# EAGLE schematic TRN_Open_Servo (EAGLE 7.1.0)
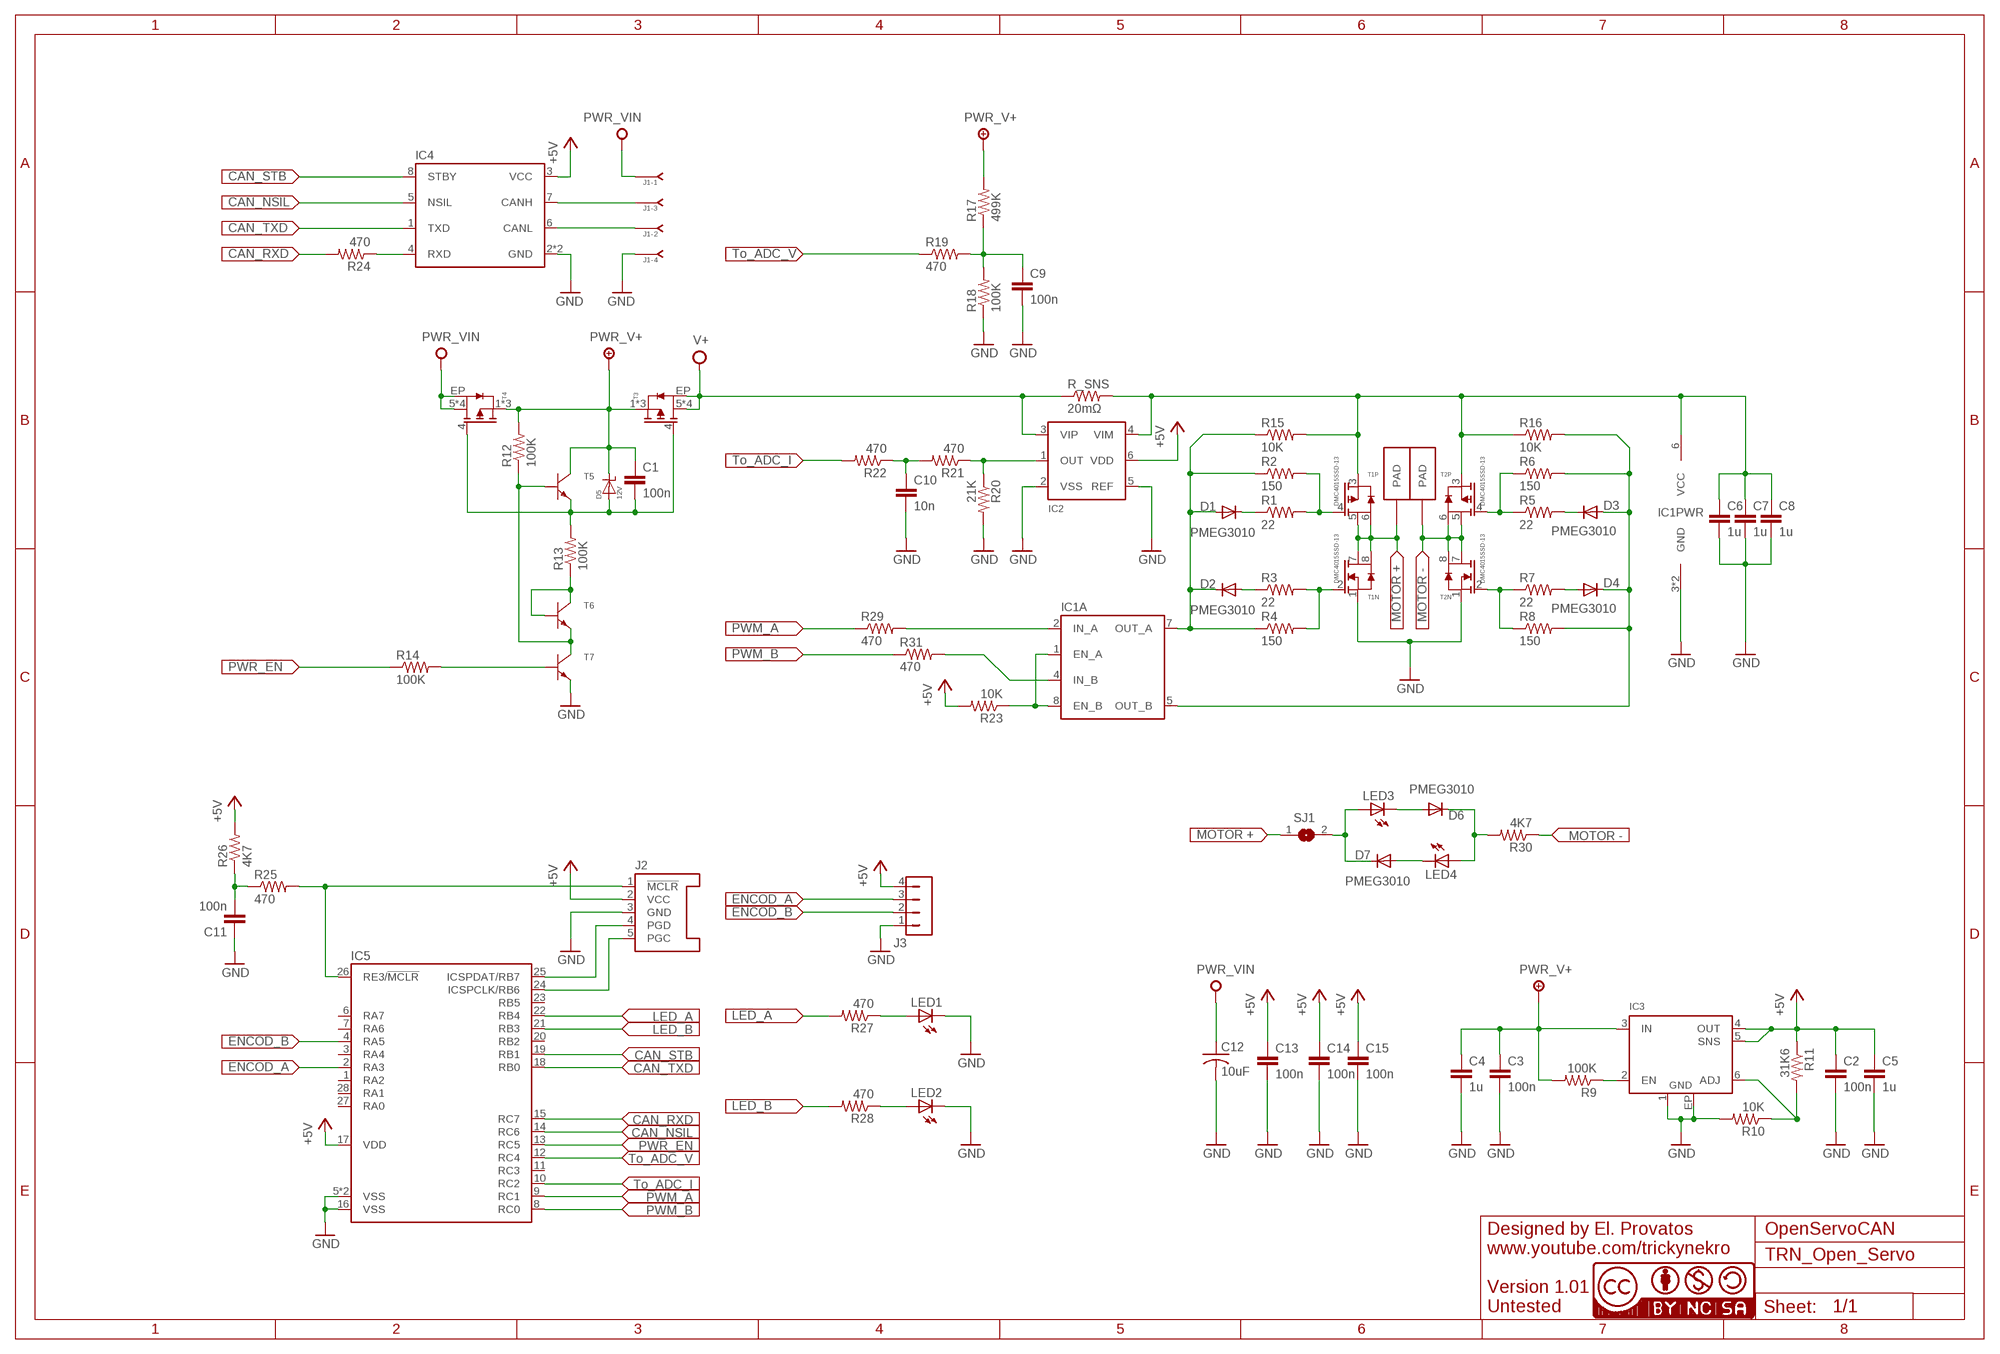
[diagram p0: schematic, sheet 1]

## Parts
C1  100n  C-EUC0402  [C0402]
C2  100n  C-EUC0402  [C0402]
C3  100n  C-EUC0402  [C0402]
C4  1u  C-EUC0603K  [C0603K]
C5  1u  C-EUC0603K  [C0603K]
C6  1u  C-EUC0603K  [C0603K]
C7  1u  C-EUC0603K  [C0603K]
C8  1u  C-EUC0603K  [C0603K]
C9  100n  C-EUC0402  [C0402]
C10  10n  C-EUC0402  [C0402]
C11  100n  C-EUC0402  [C0402]
C12  10uF  C-USC1210  [C1210]
C13  100n  C-EUC0402  [C0402]
C14  100n  C-EUC0402  [C0402]
C15  100n  C-EUC0402  [C0402]
D1  PMEG3010  DIODE-SOD523  [SOD523]
D2  PMEG3010  DIODE-SOD523  [SOD523]
D3  PMEG3010  DIODE-SOD523  [SOD523]
D4  PMEG3010  DIODE-SOD523  [SOD523]
D5  12V  DDZ12CSF  [SOD-323]
D6  PMEG3010  DIODE-SOD523  [SOD523]
D7  PMEG3010  DIODE-SOD523  [SOD523]
IC1  MCP14A0454MNY  [TDFN-8-EP]
IC2  MCP6C02SMD  [SOT-23-6]
IC3  LDO40L-ADJ  [DFN6-3X3]
IC4  ATA6560GB  [VDFN-8-EP]
IC5  PIC18F26K83ML  [QFN-28]
J1  J-04-SIP-100  [SIP-100-04]
J2  PIC-ICSP-MICRO  [PICOBLADE-5]
J3  1X4_PICOBLADE_CONNECTOR  [PICOBLADE-4]
LED1  LEDCHIP-LED0603  [CHIP-LED0603]
LED2  LEDCHIP-LED0603  [CHIP-LED0603]
LED3  LEDCHIP-LED0603  [CHIP-LED0603]
LED4  LEDCHIP-LED0603  [CHIP-LED0603]
PAD1  PLATED_SLOT  [PLATED_SLOT]
PAD2  PLATED_SLOT  [PLATED_SLOT]
R1  22  R-US_R0402  [R0402]
R2  150  R-US_R0402  [R0402]
R3  22  R-US_R0402  [R0402]
R4  150  R-US_R0402  [R0402]
R5  22  R-US_R0402  [R0402]
R6  150  R-US_R0402  [R0402]
R7  22  R-US_R0402  [R0402]
R8  150  R-US_R0402  [R0402]
R9  100K  R-US_R0402  [R0402]
R10  10K  R-US_R0402  [R0402]
R11  31K6  R-US_R0402  [R0402]
R12  100K  R-US_R0402  [R0402]
R13  100K  R-US_R0402  [R0402]
R14  100K  R-US_R0402  [R0402]
R15  10K  R-US_R0402  [R0402]
R16  10K  R-US_R0402  [R0402]
R17  499K  R-US_R0402  [R0402]
R18  100K  R-US_R0402  [R0402]
R19  470  R-US_R0402  [R0402]
R20  21K  R-US_R0402  [R0402]
R21  470  R-US_R0402  [R0402]
R22  470  R-US_R0402  [R0402]
R23  10K  R-US_R0402  [R0402]
R24  470  R-US_R0402  [R0402]
R25  470  R-US_R0402  [R0402]
R26  4K7  R-US_R0402  [R0402]
R27  470  R-US_R0402  [R0402]
R28  470  R-US_R0402  [R0402]
R29  470  R-US_R0402  [R0402]
R30  4K7  R-US_R0402  [R0402]
R31  470  R-US_R0402  [R0402]
R_SNS  20mΩ  R-US_R0805  [R0805]
SJ1  SJ  [SJ]
T1  DMC4015SSD-13  [SO-8]
T2  DMC4015SSD-13  [SO-8]
T3  SISA01DN  [POWERPAK-1212-8]
T4  SISA01DN  [POWERPAK-1212-8]
T5  MMBT2222AM3T5G  [SOT-723-3]
T6  MMBT2222AM3T5G  [SOT-723-3]
T7  MMBT2222AM3T5G  [SOT-723-3]
U$1  CC-NC-BCNIX  [CC-NC-B_NIX]

## Nets
+5V: C2.1 C5.1 C13.1 C14.1 C15.1 IC2.6(VDD) IC3.4(OUT) IC3.5(SNS) IC4.3(VCC) IC5.17(VDD) J2.2(VCC) J3.4 R11.1 R23.2 R26.2
CAN_NSIL: IC4.5(NSIL) IC5.14(RC6)
CAN_RXD: IC5.15(RC7) R24.2
CAN_STB: IC4.8(STBY) IC5.19(RB1)
CAN_TXD: IC4.1(TXD) IC5.18(RB0)
ENCOD_A: IC5.2(RA3) J3.3
ENCOD_B: IC5.4(RA5) J3.2
GND: C2.2 C3.2 C4.2 C5.2 C6.2 C7.2 C8.2 C9.2 C10.2 C11.1 C12.2 C13.2 C14.2 C15.2 IC1.3(PWR:GND) IC1.EP(PWR:GND) IC2.2(VSS) IC2.5(REF) IC3.1(GND) IC3.EP(GND) IC4.2(GND) IC4.EP(GND) IC5.5(VSS) IC5.16(VSS) IC5.EP(VSS) J1.4 J2.3(GND) J3.1 LED1.C LED2.C R10.2 R18.1 R20.2 T1.1(N:S) T2.1(N:S) T7.2(E)
LED_A: IC5.22(RB4) R27.2
LED_B: IC5.21(RB3) R28.2
MOTOR+: PAD1.P$1(PAD) PAD1.P$2(PAD) SJ1.1 T1.5(P:D) T1.6(P:D) T1.7(N:D) T1.8(N:D)
MOTOR-: PAD2.P$1(PAD) PAD2.P$2(PAD) R30.1 T2.5(P:D) T2.6(P:D) T2.7(N:D) T2.8(N:D)
N$1: D7.C LED3.A SJ1.2
N$2: IC3.2(EN) R9.1
N$3: D6.C LED4.A R30.2
N$4: D3.A D4.C IC1.5(A:OUT_B) R6.2 R8.2 R16.2
N$5: D1.A D2.C IC1.7(A:OUT_A) R2.1 R4.1 R15.1
N$6: D1.C R1.1
N$7: R1.2 R2.2 T1.4(P:G)
N$8: R3.2 R4.2 T1.2(N:G)
N$9: D2.A R3.1
N$10: D3.C R5.2
N$11: R5.1 R6.1 T2.4(P:G)
N$12: R7.1 R8.1 T2.2(N:G)
N$13: D4.A R7.2
N$14: IC3.6(ADJ) R10.1 R11.2
N$15: C6.1 C7.1 C8.1 IC1.6(PWR:VCC) IC2.4(VIM) R15.2 R16.1 R_SNS.2 T1.3(P:S) T2.3(P:S)
N$16: R12.1 T5.1(B) T6.2(E) T7.3(C)
N$17: IC4.7(CANH) J1.3
N$18: C1.2 D5.A R13.2 T3.4(G) T4.4(G) T5.2(E)
N$19: R13.1 T6.1(B) T6.3(C)
N$20: IC4.6(CANL) J1.2
N$21: C9.1 R17.1 R18.2 R19.2
N$22: IC1.1(A:EN_A) IC1.8(A:EN_B) R23.1
N$23: R14.2 T7.1(B)
N$24: IC5.26(RE3/!MCLR!) J2.1(!MCLR) R25.2
N$25: C11.2 R25.1 R26.1
N$27: LED1.A R27.1
N$28: IC2.1(OUT) R20.1 R21.1
N$29: IC5.24(ICSPCLK/RB6) J2.5(PGC)
N$30: IC5.25(ICSPDAT/RB7) J2.4(PGD)
N$31: C10.1 R21.2 R22.1
N$32: IC4.4(RXD) R24.1
N$33: D6.A LED3.C
N$34: D7.A LED4.C
N$35: LED2.A R28.1
N$37: IC1.2(A:IN_A) R29.2
N$38: IC1.4(A:IN_B) R31.2
PWM_A: IC5.9(RC1) R29.1
PWM_B: IC5.8(RC0) R31.1
PWR_EN: IC5.13(RC5) R14.1
PWR_V+: C1.1 C3.1 C4.1 D5.K IC3.3(IN) R9.2 R12.2 R17.2 T3.1(S) T3.2(S) T3.3(S) T4.1(S) T4.2(S) T4.3(S) T5.3(C)
PWR_VIN: C12.1 J1.1 T4.5(D) T4.6(D) T4.7(D) T4.8(D) T4.EP(D)
TO_ADC_I: IC5.10(RC2) R22.2
TO_ADC_V: IC5.12(RC4) R19.1
V+: IC2.3(VIP) R_SNS.1 T3.5(D) T3.6(D) T3.7(D) T3.8(D) T3.EP(D)
Unconnected: IC5.1(RA2) IC5.3(RA4) IC5.6(RA7) IC5.7(RA6) IC5.11(RC3) IC5.20(RB2) IC5.23(RB5) IC5.27(RA0) IC5.28(RA1)

## Notes on the sheet
- Designed by El. Provatos | OpenServoCAN
- www.youtube.com/trickynekro
- Version 1.01
- Untested

## Library data of the parts
C1-C11 C13-C15 = rcl:C-EU: CAPACITOR, European symbol
C12 = adafruit:C-US: CAPACITOR, American symbol
D1-D4 D6 D7 = diode:DIODE-: DIODE
D5 = TRN_Open_Servo:DDZ12: DDZ12CSF 0.5W SURFACE MOUNT PRECISION 12V ZENER DIODE from Diodes Incorporated in SOD-323F-2 Package Features 500mW Power Dissipation on FR-4 PCB Very Tight Tolerance on Vz Ideally Suited for Automated Assembly Processes Totally Lead-Free & Fully RoHS Compliant Halogen and Antimony Free.
IC1 = TRN_Open_Servo:MCP14A0454: MCP14A0454 The MCP14A0453/4/5 devices are high-speed dual MOSFET drivers that are capable of providing up to 4.5A of peak current while operating from a single 4.5V to 18V supply. There are three output configurations available: dual inverting (MCP14A0453), dual noninverting (MCP14A0454) and complementary (MCP14A0455). These devices feature low shoot-through current, matched rise and fall times, and short propagation delays, which make them ideal for high switching frequency applications.
IC2 = TRN_Open_Servo:MCP6C02: MCP6C02 Zero-Drift, 65V High-Side Current Sense Amplifier The Microchip Technology Inc. MCP6C02 high-side current sense amplifier is offered with preset gains of 20, 50 and 100 V/V. The Common-mode input range (VIP) is +3V to +65V. The differential-mode input range (VDM=VIP–VIM) supports unidirectional and bidirectional applications. The power supply can be set between 2.0V and 5.5V. This device is specified from -40°C to +125°C (E-Temp) and is provided in the SOT-23 package. The Zero-Drift architecture supports very low inputerrors, which allow a design to use shunt resistors of lower value (and lower power dissipation).
IC3 = TRN_Open_Servo:LDO40L: LDO40L Description The LDO40L is a 400 mA LDO regulator, designed for being used in severe automotive environments. Low quiescent current makes it suitable for applications permanently connected to battery. This feature is especially critical when electronic modules remain in active mode when ignition is off. The LDO40L embeds protection functions, such as: current limit and thermal-shutdown. The extended input voltage range, low drop voltage and low quiescent current features make it suitable also for low power industrial and consumer applications. Applications Automotive Applications Body control modules Instruments and clusters Automotive LED lighting Features Low quiescent current: typ. 45 μA at no load Wide input voltage operating range up to 38 V Low startup voltage: 3.5 V Output current up to 400mA Output voltage options: Adj from 2.5 V and fixed, 3.0, 3.3, 5.0 and 8.5 V Output voltage accuracy: ± 1% typ. @ 25 °C ± 3% (including line, load and temperature variation) Ultra low dropout: 36mV @ 100mA load current 140mV @ 400mA load current High PSRR: 70db @ 1kHz Very low noise: 20 μVRMS / VOUT Protection features: current limitation, thermal shutdown -40 °C to +125 °C operating temperature range Package: DFN6 (3x3) (wettable flanks) AEC-Q100 qualified (grade 1)
IC4 = TRN_Open_Servo:ATA6560: ATA6560 High-Speed CAN Transceiver with Standby Mode CAN FD Ready General Description The ATA6560/1 is a high-speed CAN transceiver that provides an interface between a Controller Area Net-work (CAN) protocol controller and the physical two-wire CAN bus. The transceiver is designed for high-speed (up to 5 Mbps) CAN applications in the automotive industry, providing differential transmit and receive capability to (a microcontroller with) a CAN protocol controller. If offers improved Electromagnetc Compatibility (EMC) and ESD performance, as well as features such as: Ideal passive behavior to CAN bus when the supply is off Direct interfacing to microcontrollers with supply voltages from 3V to 5V Three operating modes, together with the dedicated fail-safe features, make the ATA6560/1 an exellent choice for all types of high-speed CAN networks, expecially in nodes requiring a Low-Power mode with wake-up via the CAN bus. Features Fully ISO 11898-2, ISO 11898-5 and SAE J2284 Compliant CAN FD Ready Communication Speed up to 5Mbps Low Electromagnetic Emission (EME) and High Electromagnetic Immunity (EMI) Differential Reciever with Wide Common-Mode Range ATA6560: Silent Mode (Reciever Only) Remote Wake-Up Capability via CAN Bus Functional Behavior Predictable under All Supply Conditions Transceiver Disengages from the Bus when Not Powered Up RXD Recessive Clamping Detection High Electrostatic Discharge (ESD) Handling Capability on the Bus Pins Bus Pins Protected Against Transients in Automotive Environments Transmit Data (TXD) Dominant Time-Out Function Undervoltage Detection on Vcc and VIO Pins CANH/CANL Short-Circuit and Overtemperature Protected Qualified According to AEC-Q100: Only ATA6560-GAQW, ATA6560-GBQW ATA6561-GAQW, ATA6561-GBQW Packages: SOIC-8, VDFN-8 with Wettable Flanks (Moisture Sensitivity Level 1) Applications Classical CAN and CAN FB networks in the following applications: Automotive Industrial Aerospace Medical Consumer 2018 Microchip Technology Inc. Document Reference No.: DS20005991A
IC5 = TRN_Open_Servo:PIC18F26K83: PIC18(L)F25/26K83 28-Pin, Low-Power, High-Performance Microcontrollers with CAN Technology Description The PIC18(L)FXXK83 is a full-featured CAN product family that can be used in automotive and industrial applications. The multitude of communication peripherals found on the product family, such as CAN, SPI, two I2Cs, two UARTs, LIN, DMX, and DALI can handle a wide range of wired and wireless (using external modules) communication protocols for intelligent applications. This family includes a 12-bit ADC with Computation (ADC2) extensions for automated signal analysis to reduce the complexity of the application. This, combined with the Core Independent Peripherals integration capabilities, enables functions for motor control, power supply, sensor, signal and user interface applications. Core Features C Compiler Optimized RISC Architecture Operating Speed: - Up to 64 MHz clock operation - 62.5 ns minimum instruction cycle Two Direct Memory Access (DMA) Controllers: - Data transfers to SFR/GPR spaces from either Program Flash Memory, Data EEPROM or SFR/GPR spaces - User-programmable source and destination sizes - Hardware and software triggered data transfers System Bus Arbiter with User-Configurable Priorities for Scanner and DMA1/DMA2 with respect to the main line and interrpt execution Vectored Interrupt Capability: - Selectable high/low priority - Fixed interrupt latency - Programmable vector table base address 31-Level Deep Hardware Stack Low-Current Power-on Reset (POR) Configurable Power-up Timer (PWRT) Brown-Out Reset (BOR) Low-Power BOR (LPBOR) Option Windowed Watchdog Timer (WWDT): - Variable prescaler selection - Variable window size selection - Configurable in hardware or software Memory Up to 64 KB Flash Program Memory Up to 4 KB Data SRAM Memory Up to 1 KB Data EEPROM Memory Access Partition (MAP): - Configurable boot and app region seizes with individual write-protections Programmable Code Protection Device Information Area (DIA) stores: - Unique IDs and Devices IDs - Temp Sensor factory-calibrated data - Fixed Voltage Reference calibrated data Device Configuration Information (DCI) stores: - Erase row size - Number of write latches per row - Number of user rows - Data EEPROM memory size - Pin Count Operating Characteristics Operating Voltage Range: - 1.8V to 3.6V (PIC18LF25/26K83) - 2.3V to 5.5V (PIC18F25/26K83) Temperature Range: - Industrial: -40°C to 85°C - Extended: -40°C to 125°C Power-Saving Functionality DOZE mode: Ability to run CPU core slower than the system clock IDLE mode: Ability to halt CPU core while internal peripherals continue operating SLEEP mode: Lowest power consumption Peripheral Module Disable (PMD): - Ability to disable unsued peripherals to minimize power consumption eXtreme Low-Power (XLP) Features Sleep mode: 60nA @1.8V, typical Windowed Watchdog Timer: 720nA @ 1.8V, typical Secondary Oscillator: 580nA @ 32 kHz Operating Current: - 4 uA @ 32kHz, 1.8V, typical - 45uA/MHz @ 1.8V, typical Digital Peripherals Three 8-Bit Timers (TMR2/4/6) with Hardware Limit Timer (HLT): - Hardware monitoring and Fault detection Four 16-Bit Timers (TMR0/1/3/5) Four Configurable Logic Cell (CLC): - Integrated combinational and sequential logic Three Complementary Waveform Generators (CWGs): - Rising and falling edge dead-band control - Full-bridge, half-bridge, 1-channel drive - Multiple signal sources - Programmable dead band - Fault-shutdown input Four Capture/Compare/PWM (CCP) modules Four 10-Bit Pulse-Width Modulators (PWMs) Numerically Controlled Oscillator (NCO): - Generates true linear frequency control - High resolution using 20-bit accumulator and 20-bit increment values DSM: Data Signal Modulator: - Multiplex two carrier clocks, with glitch pre- vention feature - Multiple sources for each carrier Programmable CRC with Memory Scan: - Reliable data/program memory monitoring for fail-safe operation(e.g., Class B) - Calculate CRC over any portion of program memory Two UART Modules: - Modules are Asynchronous, RS-232, RS-485 compatibility - One of the UART modules supports LIN Master and Slave DMX mode, DALI Gear and Device protocols - Automatic and user-timed BREAK period generation - DMA Compatible - Automatic checksums - Programmable 1, 1.5 and two Stop bits - Wake-up on BREAK reception One SPI module: - Configurable length bytes - Configurable length data packets - Receive-without-transmit option - Transmit-without-receive option - Transfer byte counter - Seperate Transmit and Receive Buffers with 2-byte FIFO and DMA capabilities CAN module: - Conforms to CAN 2.0B Active Specification - Three operating modes: Legacy (compatible with existing PIC18CXX8/FXX8 CAN modules), Enhanced mode and FIFO mode. - Message bit rates up to 1 Mbps - DeviceNetTM data byte filter support - Six programmable receive / transmit buffers - Three dedicated transmit buffers - Two dedicated receive buffers - 16 Full, 29-Bit acceptance filters with dynamic assosiation - Three full, 29-Bit acceptance masks - Automatic remote frame handling - Advanced error management features Two I2C modules, SMBus, PMBusTM compatible: - Dedicated Address, Transmit and Receive buffers - Bus Collision Detection with arbitration - Bus time-out detection and handling - Multi-Master mode - Separate Transmit and Receive Buffers with 2-Byte FIFO and DMA capabilities - I2C, SMBus 2.0 and SMBus 3.0 and 1.8V input level selections Device I/O Port Features: - 25 I/O pins (PIC18F(L)F25K83) - One input-only pin - Individually programmable I/O direction, open-drain, slew rate, weak pull-up control - Interrupt-on-change - Three External Interrupt Pins Peripheral Pin Select (PPS): - Enables pin mapping of digital I/O Two Signal Measurement Timer (SMT): - 24-Bit timer/counter with prescaler Analog Peripherals Analog-to-Digital Converter with Computation (ADC2): - 12-Bit with up to 24 external channels - Automated math functions on input signals: averaging, filter calculations, oversampling and threshold comparison - Operates in Sleep - Integrated charge pump for improved low-voltage operation Hardware Capacitive Voltage Divider (CVD): - Automates touch sampling and reduces software size and CPU usage when touch or proximity sensing is required - Adjustable sample and hold capacitor array - Two guard ring output drives Temperature Sensor: - Internal connection to ADC - Can be calibrated for improved accuracy Two Comparators: - Low-Power / High-Speed mode - Fixed Voltage Reference at non-inverting input(s) - Comparator outputs externally accessible 5-Bit Digital-to-Analog Converter (DAC): - 5-Bit resolution, rail-to-rail - Positive Reference Selection - Unbuffered I/O pin output - Internal connections to ADCs and comparators Voltage Reference: - Fixed Voltage Reference with 1.024V, 2.048 and 4.096V output levels Flexible Oscillator Structure High-Precision Internal Oscillator: - Selectable frequency range up to 64 MHz - ±1% at calibration (nominal) Low-Power Internal 32 kHz Oscillator (LFINTOSC) External 32 kHz Crystal Oscillator (SOCS) External Oscillator Block with: - x4 PLL with external sources - Three crystal / resonator modes up to 20 MHz - Three external clock modes up to 20 MHz Fail-Safe Clock Monitor Oscillator Start-up Timer (OST): - Ensures stability of crystal oscillator sources Source: PIC18(L)F25/26K83 <http://ww1.microchip.com/downloads/en/DeviceDoc/40001943A.pdf>
J1 = con-headers-jp:J-04-: HEADER JACK PINS
J2 = TRN_Open_Servo:PIC-ICSP: Microchip PIC Microcontroller ICSP based on a 5 PIN Molex PICO-Blade pin header
J3 = TRN_Open_Servo:1X4_PICOBLADE_CONNECTOR: 1X4 PICOBlade Connector from Molex 1.25mm Pitch
LED1-LED4 = led:LED: LED OSRAM: - CHIPLED LG R971, LG N971, LY N971, LG Q971, LY Q971, LO R971, LY R971 LH N974, LH R974 LS Q976, LO Q976, LY Q976 LO Q996 - Hyper CHIPLED LW Q18S LB Q993, LB Q99A, LB R99A - SideLED LS A670, LO A670, LY A670, LG A670, LP A670 LB A673, LV A673, LT A673, LW A673 LH A674 LY A675 LS A676, LA A676, LO A676, LY A676, LW A676 LS A679, LY A679, LG A679 - Hyper Micro SIDELED® LS Y876, LA Y876, LO Y876, LY Y876 LT Y87S - SmartLED LW L88C, LW L88S LB L89C, LB L89S, LG L890 LS L89K, LO L89K, LY L89K LS L896, LA L896, LO L896, LY L896 - TOPLED LS T670, LO T670, LY T670, LG T670, LP T670 LSG T670, LSP T670, LSY T670, LOP T670, LYG T670 LG T671, LOG T671, LSG T671 LB T673, LV T673, LT T673, LW T673 LH T674 LS T676, LA T676, LO T676, LY T676, LB T676, LH T676, LSB T676, LW T676 LB T67C, LV T67C, LT T67C, LS T67K, LO T67K, LY T67K, LW E67C LS E67B, LA E67B, LO E67B, LY E67B, LB E67C, LV E67C, LT E67C LW T67C LS T679, LY T679, LG T679 LS T770, LO T770, LY T770, LG T770, LP T770 LB T773, LV T773, LT T773, LW T773 LH T774 LS E675, LA E675, LY E675, LS T675 LS T776, LA T776, LO T776, LY T776, LB T776 LHGB T686 LT T68C, LB T68C - Hyper Mini TOPLED® LB M676 - Mini TOPLED Santana® LG M470 LS M47K, LO M47K, LY M47K Source: http://www.osram.convergy.de LUXEON: - LUMILED® LXK2-PW12-R00, LXK2-PW12-S00, LXK2-PW14-U00, LXK2-PW14-V00 LXK2-PM12-R00, LXK2-PM12-S00, LXK2-PM14-U00 LXK2-PE12-Q00, LXK2-PE12-R00, LXK2-PE12-S00, LXK2-PE14-T00, LXK2-PE14-U00 LXK2-PB12-K00, LXK2-PB12-L00, LXK2-PB12-M00, LXK2-PB14-N00, LXK2-PB14-P00, LXK2-PB14-Q00 LXK2-PR12-L00, LXK2-PR12-M00, LXK2-PR14-Q00, LXK2-PR14-R00 LXK2-PD12-Q00, LXK2-PD12-R00, LXK2-PD12-S00 LXK2-PH12-R00, LXK2-PH12-S00 LXK2-PL12-P00, LXK2-PL12-Q00, LXK2-PL12-R00 Source: www.luxeon.com KINGBRIGHT: KA-3528ASYC Source: www.kingbright.com
PAD1 PAD2 = TRN_Open_Servo:PLATED_SLOT: Plated Slot / Pad for small DC motor leads
R1-R31 R_SNS = rcl:R-US_: RESISTOR, American symbol
SJ1 = jumper:SJ: SMD solder JUMPER
T1 T2 = TRN_Open_Servo:DMC4015SSD: DMC4015SSD COMPLEMENTARY PAIR ENHANCEMENT MODE MOSFET Description This new generation MOSFET is designed to minimize the on-state resistance (RDS(ON)) yet maintain superior switching performance, which makes it ideal for high-efficiency power management applications. Applications DC-DC Converters Power Management Functions Backlighting
T3 T4 = TRN_Open_Servo:SISA01DN: SiSA01DN P-Channel 30V (D-S) MOSFET FEATURES TrenchFET® Gen IV p-channel power MOSFET Provides exceptionally low RDS(ON) in a compact package that is thermally enhanced Enables higher power density 100% Rg and UIS tested Material categorization: for definitions of compliance please see: Document No. 99912 APPLICATIONS Battery management in mobile devices Adapter and charger switch Battery switch Load switch
T5-T7 = TRN_Open_Servo:MMBT2222AM3T5G: MMBT2222AM3T5G NPN General Purpose Transistor The MMBT2222AM3T5G device is a spin−off of our popular SOT−23 three−leaded device. It is designed for general purpose amplifier applications and is housed in the SOT−723 surface mount package. This device is ideal for low−power surface mount applications where board space is at a premium Features Reduces Board Space NSV Prefix for Automotive and Other Applications Requiring Unique Site and Control Change Requirements; AEC−Q101 Qualified and PPAP Capable These Devices are Pb−Free, Halogen Free/BFR Free and are RoHS Compliant
U$1 = cc-by-nc-sa:CC-NC-BC: All hardware is licensed under the Creative Commons Attribution-Noncommercial-Share Alike 2.5 Switzerland License. To view a copy of this license, visit http://creativecommons.org/licenses/by-nc-sa/2.5/ch/ or send a letter to Creative Commons, 171 Second Street, Suite 300, San Francisco, California, 94105, USA.